# EAGLE design openSX70_ALPHA-2_V6-2-51-20190105-S2-22 (EAGLE 9.2.0)
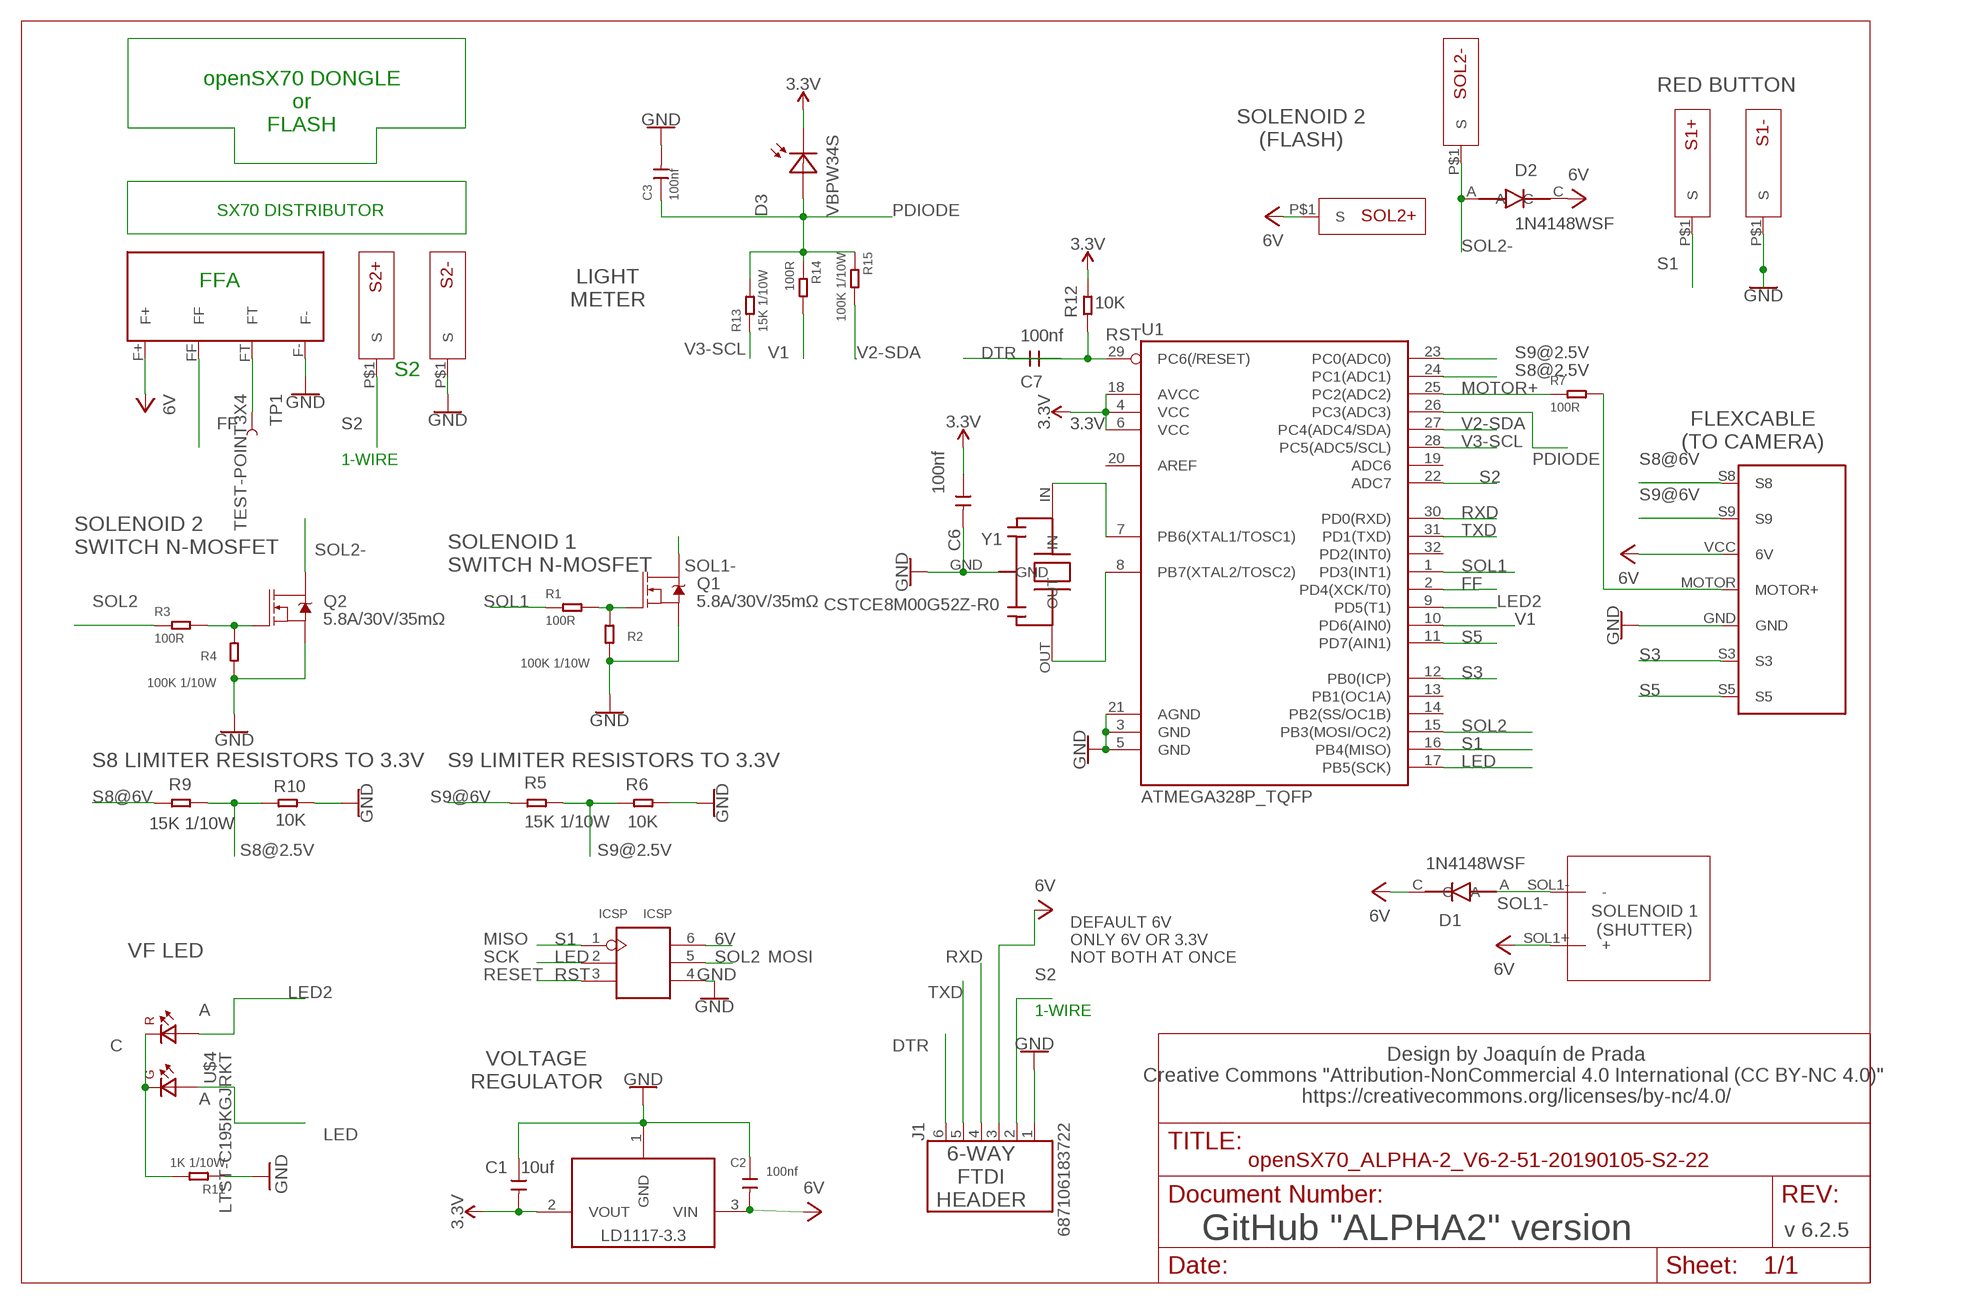
[diagram p0: schematic, sheet 1]

## Parts
C1  10uf  CERAMIC-10UF-10V-10%-X5R(0603)  [C0603]
C2  100nf  CERAMIC-100NF-50V-10%-X7R(0603)  [C0603]
C3  100nf  CERAMIC-100NF-50V-10%-X7R(0603)  [C0603]
C6  100nf  CERAMIC-100NF-50V-10%-X7R(0603)  [C0603]
C7  100nf  CERAMIC-100NF-50V-10%-X7R(0603)  [C0603]
D1  1N4148WSF  1N4148WS  [SODFL2512X100N]
D2  1N4148WSF  1N4148WS  [SODFL2512X100N]
D3  VBPW34S  [SOD6439X130N]
ICSP  ICSP  [H2X3-2.54]
J1  687106183722  [687106183722]
LD11172.5V  LD1117 2.5V  LD1117-3.3  [SOT223]
Q1  5.8A/30V/35mΩ  MOSFET-NCH-AO3404A  [SOT23-3]
Q2  5.8A/30V/35mΩ  MOSFET-NCH-AO3404A  [SOT23-3]
R1  100R  SMD-RES-100R-5%-1/10W(0603)  [R0603]
R2  100K 1/10W  SMD-RES-100K-5%-1/10W(0603)  [R0603]
R3  100R  SMD-RES-100R-5%-1/10W(0603)  [R0603]
R4  100K 1/10W  SMD-RES-100K-5%-1/10W(0603)  [R0603]
R5  15K 1/10W  SMD-RES-15K-1%-1/10W(0603)  [R0603]
R6  10K  SMD-RES-10K-1%-1/10W(0603)  [R0603]
R7  100R  SMD-RES-100R-5%-1/10W(0603)  [R0603]
R9  15K 1/10W  SMD-RES-15K-1%-1/10W(0603)  [R0603]
R10  10K  SMD-RES-10K-1%-1/10W(0603)  [R0603]
R11  1K 1/10W  SMD-RES-1K-5%-1/10W(0603)  [R0603]
R12  10K  SMD-RES-10K-1%-1/10W(0603)  [R0603]
R13  15K 1/10W  SMD-RES-15K-1%-1/10W(0603)  [R0603]
R14  100R  SMD-RES-100R-5%-1/10W(0603)  [R0603]
R15  100K 1/10W  SMD-RES-100K-5%-1/10W(0603)  [R0603]
S1+  SX70-S-PAD-NEW  [SX70-S-PAD2]
S1-  SX70-S-PAD-NEW  [SX70-S-PAD2]
S2+  SX70-S-PAD-NEW  [SX70-S-PAD2]
S2-  SX70-S-PAD-NEW  [SX70-S-PAD2]
SOL1  SX70-SOLENOID1-2PADS  [SX70-SOLENOID1-2]
SOL2+  SX70-S-PAD-NEW  [SX70-S-PAD2]
SOL2-  SX70-S-PAD-NEW  [SX70-S-PAD2]
TP1  TEST-POINT3X4  [PAD.03X.04]
U1  ATMEGA328P_TQFP  [TQFP32-08]
U$1  SX70-7-PAD  [SX70-7-PAD-PROPER]
U$2  FFA  SX70-FFA-PAD  [FFA-PAD-PACKAGE]
U$4  LTST-C195KGJRKT  [LTST-BILED-15X16]
Y1  CSTCE8M00G52Z-R0  CSTCE16M0V53-R0  [CFP95P160X100-3N]

## Nets
3.3V: C1.2 C6.1 D3.C LD11172.5V.2(VOUT) R12.2 U1.4(VCC) U1.6(VCC) U1.18(AVCC)
6V: C2.2 D1.C D2.C ICSP.6(VCC) J1.3 LD11172.5V.3(VIN) SOL1.SOL1+(+) SOL2+.P$1(S) U$1.VCC(6V) U$2.F+
DTR: C7.1 J1.6
FF: U1.2(PD4(XCK/T0)) U$2.FF
GND: C1.1 C2.1 C3.2 C6.2 ICSP.4(GND) J1.1 LD11172.5V.1(GND) Q1.2(S) Q2.2(S) R2.1 R4.1 R6.2 R10.2 R11.1 S1-.P$1(S) S2-.P$1(S) U1.3(GND) U1.5(GND) U1.21(AGND) U$1.GND U$2.F- Y1.GND
LED: ICSP.2(SCK) U1.17(PB5(SCK)) U$4.P$1(A1)
LED2: U1.9(PD5(T1)) U$4.P$2(A2)
MOTOR+: R7.1 U1.25(PC2(ADC2))
MOTOR-HEADER: R7.2 U$1.MOTOR(MOTOR+)
N$1: Q1.1(G) R1.2 R2.2
N$2: R11.2 U$4.P$3(K1) U$4.P$4(K2)
N$3: Q2.1(G) R3.2 R4.2
N$4: U1.7(PB6(XTAL1/TOSC1)) Y1.IN
N$5: TP1.P$1 U$2.FT
N$6: U1.8(PB7(XTAL2/TOSC2)) Y1.OUT
PDIODE: C3.1 D3.A R13.2 R14.1 R15.1 U1.26(PC3(ADC3))
RST: C7.2 ICSP.3(RST) R12.1 U1.29(PC6(/RESET))
RXD: J1.4 U1.30(PD0(RXD))
S1: ICSP.1(MISO) S1+.P$1(S) U1.16(PB4(MISO))
S2: J1.2 S2+.P$1(S) U1.22(ADC7)
S3: U1.12(PB0(ICP)) U$1.S3
S5: U1.11(PD7(AIN1)) U$1.S5
S8@2.5V: R9.2 R10.1 U1.24(PC1(ADC1))
S8@6V: R9.1 U$1.S8
S9@2.5V: R5.2 R6.1 U1.23(PC0(ADC0))
S9@6V: R5.1 U$1.S9
SOL1: R1.1 U1.1(PD3(INT1))
SOL1-: D1.A Q1.3(D) SOL1.SOL1-(-)
SOL2: ICSP.5(MOSI) R3.1 U1.15(PB3(MOSI/OC2))
SOL2-: D2.A Q2.3(D) SOL2-.P$1(S)
TXD: J1.5 U1.31(PD1(TXD))
V1: R14.2 U1.10(PD6(AIN0))
V2-SDA: R15.2 U1.27(PC4(ADC4/SDA))
V3-SCL: R13.1 U1.28(PC5(ADC5/SCL))
Unconnected: U1.13(PB1(OC1A)) U1.14(PB2(SS/OC1B)) U1.19(ADC6) U1.20(AREF) U1.32(PD2(INT0))

## Notes on the sheet
- RED BUTTON
- openSX70 DONGLE
  or
  FLASH
- SOLENOID 2
  (FLASH)
- SX70 DISTRIBUTOR
- FFA
- LIGHT
  METER
- S2
- FLEXCABLE
  (TO CAMERA)
- 1-WIRE
- SOLENOID 2
  SWITCH N-MOSFET
- SOLENOID 1
  SWITCH N-MOSFET
- S8 LIMITER RESISTORS TO 3.3V | S9 LIMITER RESISTORS TO 3.3V
- SOLENOID 1
  (SHUTTER)
- MISO
- SCK | MOSI
- VF LED | RESET
- DEFAULT 6V
  ONLY 6V OR 3.3V
  NOT BOTH AT ONCE
- A | 1-WIRE
- C
- VOLTAGE
  REGULATOR
- Design by Joaquín de Prada
  Creative Commons "Attribution-NonCommercial 4.0 International (CC BY-NC 4.0)" 
  https://creativecommons.org/licenses/by-nc/4.0/
- A
- 6-WAY
  FTDI
  HEADER
- v 6.2.5
- GitHub "ALPHA2" version

## Library data of the parts
C1 = Seeed-Capacitor:CERAMIC-10UF-10V-10%-X5R(0603): 302010103; MPN: CC0603KRX5R6BB106
C2 C3 C6 C7 = Seeed-Capacitor:CERAMIC-100NF-50V-10%-X7R(0603): 302010138; MPN: CC0603KRX7R9BB104
D1 D2 = Common-Parts-Library-Eagle:1N4148WS: 1N4148WS Series 75 V 300 mA Surface Mount Small Signal Diodes - SOD-323F; MANUFACTURER: Fairchild Semiconductor
D3 = VBPW34S:VBPW34S: VBPW34SR Series 60 V 940 nm 50 mA 215 mW Surface Mount Silicon PIN Photodiode; DESCRIPTION: VBPW34SR Series 60 V 940 nm 50 mA 215 mW Surface Mount Silicon PIN Photodiode; DIGI-KEY_PART_NUMBER: 751-1500-1-ND; DIGI-KEY_PURCHASE_URL: https://www.digikey.es/product-detail/en/vishay-semiconductor-opto-division/VBPW34S/751-1500-1-ND/2354866?utm_source=snapeda&utm_medium=aggregator&utm_campaign=symbol; MF: Vishay; MP: VBPW34S; PACKAGE: SMD-2 Vishay
ICSP = openSX70:ICSP
J1 = 687106183722:687106183722: 687106183722 WR-FPC 0.50mm SMT Horizontal Bottom Contact - Low Profile <http://katalog.we-online.de/media/images/v2/Family_WR-FPC_6871xx183722.jpg> Details see: http://katalog.we-online.de/en/em/FPC_0_5_SMT_ZIF_HORIZONTAL_BOTTOM_CONTACT_LOW_PROFILE_6871xx183722 Created by Yingchun,shan 2016 (C) Wurth Elektronik; AVAILABILITY: Good; DESCRIPTION: CONN FFC BTM 6POS 0.5MM SMD R/A; MF: Wurth Electronics; MP: 687106183722; PACKAGE: None; PRICE: 1.21 USD
LD11172.5V = openSX70:LD1117-3.3; AVAILABILITY: Unavailable; DESCRIPTION: Sot223/Pkg 1-Amp 5-Volt Low Drop Out Voltage Regulatator; MF: Advanced Monolithic Systems; MP: AMS1117-5.0; PACKAGE: None; PRICE: None
Q1 Q2 = openSX70:MOSFET-NCH: N-channel MOSFETs Voltage controlled devices that allow control of high current outputs. SparkFun Products: SparkFun OpenScale <https://www.sparkfun.com/products/13261> SparkFun Digital Sandbox <https://www.sparkfun.com/products/12651> SparkFun Monster Moto Shield <https://www.sparkfun.com/products/10182> SparkFun MOSFET Power Controller <https://www.sparkfun.com/products/11214>; PROD_ID: TRANS-12988
R1 R3 R7 R14 = Seeed-Resistor:SMD-RES-100R-5%-1/10W(0603): 301010090; MPN: RC0603JR-07100RL
R2 R4 R15 = Seeed-Resistor:SMD-RES-100K-5%-1/10W(0603): 301010089; MPN: RC0603JR-07100KL
R5 R9 R13 = Seeed-Resistor:SMD-RES-15K-1%-1/10W(0603): 301010241; MPN: RC0603FR-0715KL
R6 R10 R12 = Seeed-Resistor:SMD-RES-10K-1%-1/10W(0603): 301010299; MPN: RC0603FR-0710KL
R11 = Seeed-Resistor:SMD-RES-1K-5%-1/10W(0603): 301010291; MPN: RC0603JR-071KL
S1+ S1- S2+ S2- SOL2+ SOL2- = openSX70:SX70-S-PAD-NEW
SOL1 = openSX70:SX70-SOLENOID1-2PADS
TP1 = SparkFun-Connectors:TEST-POINT: SparkFun Test Points Bare copper test points for troubleshooting or In-Circuit-Testing. These are used by our Production team for verifying production board runs using pogo-pins on test beds. SparkFun Products: SparkFun LSM9DS1 Breakout <https://www.sparkfun.com/products/13284> SparkFun PSOC <https://www.sparkfun.com/products/13714> SparkFun Load Cell Amplifier <https://www.sparkfun.com/products/13879>
U1 = openSX70:ATMEGA328P_TQFP: Popular 328P in QFP Storefront component: ATmega328 - TQFP <https://www.sparkfun.com/products/13448> (COM-13448) Datasheet <http://www.sparkfun.com/datasheets/Components/SMD/ATMega328.pdf> SparkFun Products SparkFun RedBoard - Programmed with Arduino <https://www.sparkfun.com/products/12757> (DEV-12757) Arduino Pro Mini 328 - 5V/16MHz <https://www.sparkfun.com/products/11113> (DEV-11113) Arduino Pro Mini 328 - 3.3V/8MHz <https://www.sparkfun.com/products/11114> (DEV-11114) SparkFun OpenLog <https://www.sparkfun.com/products/13712> (DEV-13712) SparkFun MicroView - OLED Arduino Module <https://www.sparkfun.com/products/12923> (DEV-12923) SparkFun Digital Sandbox <https://www.sparkfun.com/products/12651> (DEV-12651) SparkFun PicoBoard <https://www.sparkfun.com/products/11888> (WIG-11888) Arduino Fio <https://www.sparkfun.com/products/10116> (DEV-10116) LilyPad Arduino 328 Main Board <https://www.sparkfun.com/products/13342> (DEV-13342) SparkFun RedStick <https://www.sparkfun.com/products/13741> (DEV-13741) LilyPad MP3 <https://www.sparkfun.com/products/11013> (DEV-11013) LilyPad Arduino SimpleSnap <https://www.sparkfun.com/products/10941> (DEV-10941) SparkFun Stepoko <https://www.sparkfun.com/products/13899> (ROB-13899) SparkFun Geiger Counter <https://www.sparkfun.com/products/11345> (SEN-11345) SparkFun EL Sequencer <https://www.sparkfun.com/products/12781> (COM-12781) Arduino Pro 328 - 5V/16MHz <https://www.sparkfun.com/products/10915> (DEV-10915) CryptoCape <https://www.sparkfun.com/products/12773> (DEV-12773) SparkFun IR Thermometer Evaluation Board - MLX90614 <https://www.sparkfun.com/products/10740> (SEN-10740) SparkFun RedBot Mainboard <https://www.sparkfun.com/products/12097> (ROB-12097) Arduino Pro 328 - 3.3V/8MHz <https://www.sparkfun.com/products/10914> (DEV-10914) SparkFun Block for Intel® Edison - Arduino <https://www.sparkfun.com/products/13036> (DEV-13036) SparkFun Simon Says - Surface Mount Soldering Kit <https://www.sparkfun.com/products/10935> (KIT-10935) SparkFun 7-Segment Serial Display - Red <https://www.sparkfun.com/products/11441> (COM-11441) SparkFun 7-Segment Serial Display - White <https://www.sparkfun.com/products/11629> (COM-11629) SparkFun 7-Segment Serial Display - Yellow <https://www.sparkfun.com/products/11443> (COM-11443) SparkFun 7-Segment Serial Display - Kelly Green <https://www.sparkfun.com/products/11440> (COM-11440) SparkFun 7-Segment Serial Display - Blue <https://www.sparkfun.com/products/11442> (COM-11442) SparkFun OpenSegment Serial Display - 20mm (Blue) <https://www.sparkfun.com/products/11647> (COM-11647) SparkFun OpenSegment Serial Display - 20mm (Green) <https://www.sparkfun.com/products/11646> (COM-11646) SparkFun OpenSegment Serial Display - 20mm (White) <https://www.sparkfun.com/products/11648> (COM-11648) SparkFun OpenSegment Serial Display - 20mm (Red) <https://www.sparkfun.com/products/11644> (COM-11644) SparkFun OpenSegment Serial Display - 20mm (Yellow) <https://www.sparkfun.com/products/11645> (COM-11645) SparkFun OpenSegment Shield <https://www.sparkfun.com/products/13190> (DEV-13190); PROD_ID: IC-09069
U$1 = _openSX70:SX70-7-PAD
U$2 = openSX70:SX70-FFA-PAD
U$4 = LTST-C195KGJRKT:LTST-C195KGJRKT; AVAILABILITY: Unavailable; DESCRIPTION: Green/Red 130° Water Clear 35/25 mcd 2 V 0605 Surface Mount Bi-Color LED; MF: Lite-On Inc.; MP: LTST-C195KGJRKT; PACKAGE: 0606 Lite-On; PRICE: None
Y1 = CSTCE16M0V53-R0:CSTCE16M0V53-R0: Ceramic Resonator 16MHz ±0.5% (Tol) ±0.3% (Stability) 15pF 40Ohm 3-Pin CSMD T/R; AVAILABILITY: Good; DESCRIPTION: Ceramic Resonator 16MHz ??0.5% (Tol) ??0.3% (Stability) 15pF 40Ohm 3-Pin CSMD T/R; MF: Murata; MP: CSTCE16M0V53-R0; PACKAGE: SMD-3 Murata; PRICE: 0.28 USD

## Net classes
0 default: width 0.254 mm
1 GND: width 0.61 mm

## Board
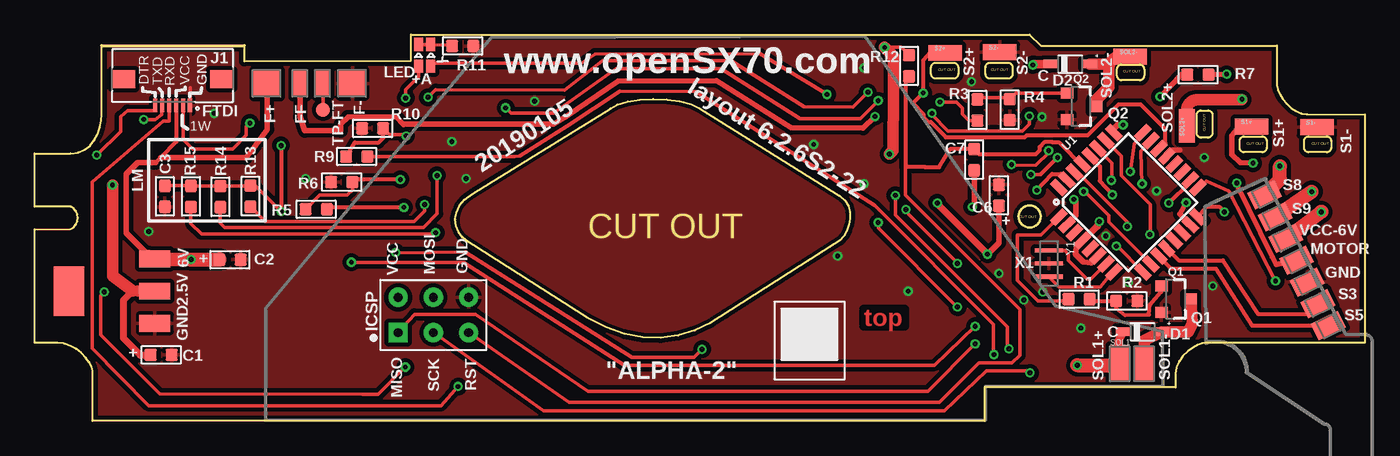
[diagram p1: board, top side]
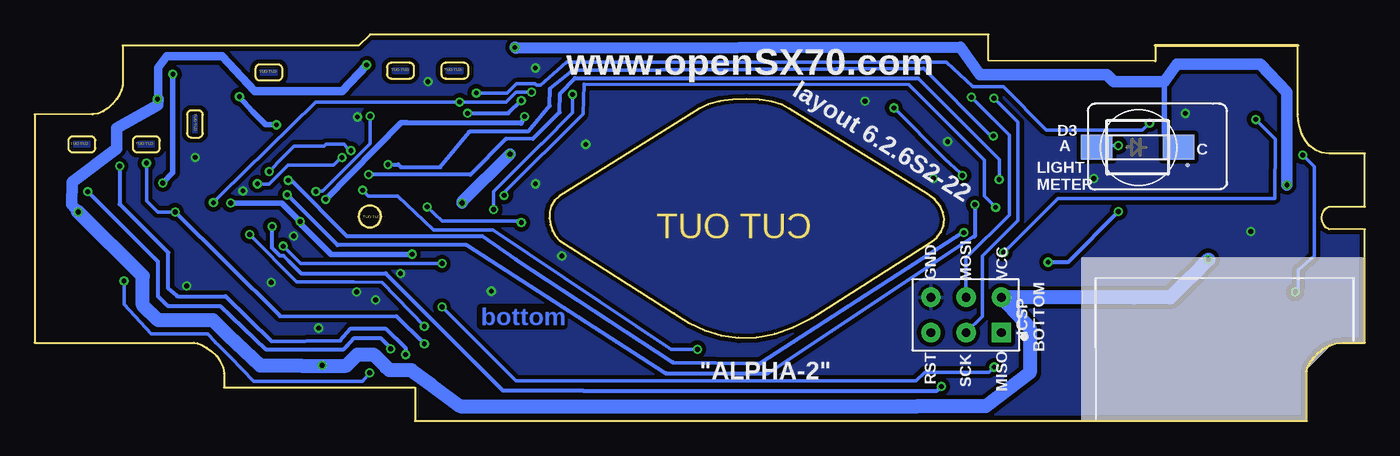
[diagram p2: board, bottom side, seen from below]

Size 95.88 x 27.86 mm. Coordinates in mm from the lower left corner, seen from the top.
Outline: 71.72,15.54 71.88,15.53 72.03,15.48 72.17,15.41 72.29,15.31
Outline: 72.29,15.31 72.39,15.19 72.46,15.06 72.51,14.91 72.52,14.74
Outline: 72.52,14.74 72.51,14.58 72.46,14.43 72.39,14.3 72.29,14.18
Outline: 72.29,14.18 72.17,14.08 72.03,14.01 71.88,13.96 71.72,13.94
Outline: 71.72,13.94 71.56,13.96 71.41,14.01 71.28,14.08 71.16,14.18
Outline: 71.16,14.18 71.06,14.3 70.99,14.43 70.94,14.58 70.92,14.74
Outline: 70.92,14.74 70.94,14.91 70.99,15.06 71.06,15.19 71.16,15.31
Outline: 71.16,15.31 71.28,15.41 71.41,15.48 71.56,15.53 71.72,15.54
Outline: 71.72,15.54 71.57,15.53 71.42,15.48 71.28,15.41 71.16,15.31
Outline: 71.16,15.31 71.06,15.19 70.98,15.05 70.94,14.9 70.92,14.74
Outline: 70.92,14.74 70.94,14.59 70.98,14.44 71.06,14.3 71.16,14.18
Outline: 71.16,14.18 71.28,14.08 71.42,14.01 71.57,13.96 71.72,13.94
Outline: 71.72,13.94 71.88,13.96 72.03,14.01 72.17,14.08 72.29,14.18
Outline: 72.29,14.18 72.39,14.3 72.46,14.44 72.51,14.59 72.52,14.74
Outline: 72.52,14.74 72.51,14.9 72.46,15.05 72.39,15.19 72.29,15.31
Outline: 72.29,15.31 72.17,15.41 72.03,15.48 71.88,15.53 71.72,15.54
Outline: 91.7,22.11 91.77,22.11 95.88,22.11 95.88,5.64 84.4,5.64 84.15,5.6 83.83,5.47 83.48,5.27 83.11,5.01 82.78,4.68 82.5,4.3 82.31,3.87 82.24,3.4 82.24,2.41 68.47,2.41 68.47,0 4.17,0 4.17,3.6 4.11,3.9 3.94,4.23 3.69,4.56 3.36,4.89 2.98,5.18 2.56,5.42 2.11,5.58 1.66,5.64 0,5.64 0,13.82 2.59,13.84 2.81,13.96 2.98,14.15 3.07,14.39 3.1,14.65 3.07,14.91 2.97,15.15 2.81,15.34 2.59,15.45 0,15.46 0,19.29 2.59,19.29 3.14,19.36 3.6,19.56 3.99,19.87 4.3,20.26 4.53,20.7 4.7,21.17 4.79,21.65 4.82,22.11 4.82,27.07 15.1,27.07 15.1,25.94 27.12,26 27.12,27.86 71.71,27.86 72.52,27.07 89.55,27.07 89.55,24.21 89.61,23.9 89.76,23.56 89.97,23.21 90.25,22.87 90.57,22.57 90.93,22.33 91.31,22.17 91.7,22.11
Outline: 83.76,20.77 83.76,22.06 83.77,22.12 83.79,22.19 83.82,22.24 83.86,22.29 83.91,22.33 83.96,22.36 84.03,22.38 84.09,22.39 84.57,22.39 84.64,22.38 84.7,22.36 84.76,22.33 84.81,22.29 84.85,22.24 84.88,22.19 84.9,22.12 84.9,22.06 84.9,20.77 84.9,20.7 84.88,20.64 84.85,20.58 84.81,20.53 84.76,20.49 84.7,20.46 84.64,20.44 84.57,20.44 84.09,20.44 84.03,20.44 83.96,20.46 83.91,20.49 83.86,20.53 83.82,20.58 83.79,20.64 83.77,20.7 83.76,20.77
Outline: 87.19,20.53 88.48,20.53 88.54,20.52 88.61,20.5 88.66,20.47 88.71,20.43 88.75,20.38 88.78,20.32 88.8,20.26 88.81,20.19 88.81,19.71 88.8,19.65 88.78,19.59 88.75,19.53 88.71,19.48 88.66,19.44 88.61,19.41 88.54,19.39 88.48,19.38 87.19,19.38 87.12,19.39 87.06,19.41 87,19.44 86.95,19.48 86.91,19.53 86.88,19.59 86.86,19.65 86.86,19.71 86.86,20.19 86.86,20.26 86.88,20.32 86.91,20.38 86.95,20.43 87,20.47 87.06,20.5 87.12,20.52 87.19,20.53
Outline: 91.84,20.53 93.13,20.53 93.2,20.52 93.26,20.5 93.32,20.47 93.37,20.43 93.41,20.38 93.44,20.32 93.46,20.26 93.46,20.19 93.46,19.71 93.46,19.65 93.44,19.59 93.41,19.53 93.37,19.48 93.32,19.44 93.26,19.41 93.2,19.39 93.13,19.38 91.84,19.38 91.78,19.39 91.71,19.41 91.66,19.44 91.61,19.48 91.57,19.53 91.54,19.59 91.52,19.65 91.51,19.71 91.51,20.19 91.52,20.26 91.54,20.32 91.57,20.38 91.61,20.43 91.66,20.47 91.71,20.5 91.78,20.52 91.84,20.53
Outline: 78.36,25.71 79.65,25.71 79.71,25.7 79.78,25.68 79.83,25.65 79.88,25.61 79.92,25.56 79.95,25.5 79.97,25.44 79.98,25.37 79.98,24.9 79.97,24.83 79.95,24.77 79.92,24.71 79.88,24.66 79.83,24.62 79.78,24.59 79.71,24.57 79.65,24.56 78.36,24.56 78.29,24.57 78.23,24.59 78.17,24.62 78.12,24.66 78.08,24.71 78.05,24.77 78.03,24.83 78.02,24.9 78.02,25.37 78.03,25.44 78.05,25.5 78.08,25.56 78.12,25.61 78.17,25.65 78.23,25.68 78.29,25.7 78.36,25.71
Outline: 68.87,25.84 70.16,25.84 70.23,25.83 70.29,25.81 70.35,25.78 70.39,25.74 70.43,25.69 70.47,25.63 70.49,25.57 70.49,25.51 70.49,25.03 70.49,24.96 70.47,24.9 70.43,24.84 70.39,24.79 70.35,24.75 70.29,24.72 70.23,24.7 70.16,24.69 68.87,24.69 68.8,24.7 68.74,24.72 68.68,24.75 68.64,24.79 68.59,24.84 68.56,24.9 68.54,24.96 68.54,25.03 68.54,25.51 68.54,25.57 68.56,25.63 68.59,25.69 68.64,25.74 68.68,25.78 68.74,25.81 68.8,25.83 68.87,25.84
Outline: 64.95,25.84 66.24,25.84 66.31,25.83 66.37,25.81 66.43,25.78 66.48,25.74 66.52,25.69 66.55,25.63 66.57,25.57 66.57,25.51 66.57,25.03 66.57,24.96 66.55,24.9 66.52,24.84 66.48,24.79 66.43,24.75 66.37,24.72 66.31,24.7 66.24,24.69 64.95,24.69 64.88,24.7 64.82,24.72 64.77,24.75 64.72,24.79 64.68,24.84 64.65,24.9 64.63,24.96 64.62,25.03 64.62,25.51 64.63,25.57 64.65,25.63 64.68,25.69 64.72,25.74 64.77,25.78 64.82,25.81 64.88,25.83 64.95,25.84
Outline: 31.52,16.35 41.5,22.53 42.01,22.82 42.74,23.03 43.62,23.16 44.59,23.21 45.57,23.18 46.5,23.06 47.32,22.84 47.95,22.53 58.05,16.23 58.41,15.9 58.64,15.51 58.76,15.07 58.78,14.61 58.71,14.16 58.56,13.73 58.34,13.34 58.06,13.03 49.78,7.77 48.71,7.05 47.57,6.51 46.38,6.16 45.13,5.99 43.84,6.03 42.53,6.28 41.2,6.75 39.87,7.45 31.22,12.93 30.83,13.23 30.55,13.62 30.37,14.06 30.32,14.55 30.4,15.04 30.62,15.52 30.99,15.97 31.52,16.35
Copper layers (1*16): Top 0.035mm / dielectric 1.5mm / Bottom 0.035mm
Design rules "SeeedStudio_2layer_DRU_no_angle_20140221": minimum track width 6mil, minimum drill 12mil, track to track 6mil, track to pad 6mil, pad to pad 6mil, via to via 6mil, smd to smd 0mil, copper to edge 10mil, drill to drill 10mil, minimum pad ring 10mil, minimum via ring 6mil, stop-mask expansion 2mil, vias tented up to drill 100mil, thermal gap 10mil

### Footprints (pad centres in the part's own frame; a part is rotated, then mirrored left to right if it is on the bottom)
C0603 = smd 0.889 x 0.889: 1 0,0.762; 2 0,-0.762
SODFL2512X100N = smd 1.05 x 0.6: A 1.4,0; C -1.4,0
SOD6439X130N = smd 2.286 x 1.8: A 2.95,0; C -2.95,0
H2X3-2.54 = drill 0.635 pad 1.397 square: 1 -1.27,2.54 | drill 0.635 pad 1.397: 2 -1.27,0; 3 -1.27,-2.54; 4 1.27,-2.54; 5 1.27,0; 6 1.27,2.54
687106183722 = smd 0.3 x 1: 1 -1.25,1.9; 2 -0.75,1.9; 3 -0.25,1.9; 4 0.25,1.9; 5 0.75,1.9; 6 1.25,1.9 | smd 1.65 x 1.3: Z1 -3.525,0; Z2 3.525,0
SOT223 = smd 2.235 x 1.219: 1 -3.099,2.311; 2 -3.099,0; 3 -3.099,-2.311 | smd 2.2 x 3.6: 4 3.099,0
SOT23-3 = smd 0.8 x 0.9: 1 -0.95,-1; 2 0.95,-1; 3 0,1.1
R0603 = smd 0.889 x 0.889: 1 0,0.762; 2 0,-0.762
SX70-S-PAD2 = smd 2.413 x 1.143: P$1 0.01,0.087
SX70-SOLENOID1-2 = smd 1.372 x 2.54: SOL1+ -0.826,0.127; SOL1- 0.953,0.127
PAD.03X.04 = smd 1.016 x 1.016: P$1 0,0
TQFP32-08 = smd 1.27 x 0.559: 1 -4.293,2.8; 2 -4.293,2; 3 -4.293,1.2; 4 -4.293,0.4; 5 -4.293,-0.4; 6 -4.293,-1.2; 7 -4.293,-2; 8 -4.293,-2.8; 17 4.293,-2.8; 18 4.293,-2; 19 4.293,-1.2; 20 4.293,-0.4; 21 4.293,0.4; 22 4.293,1.2; 23 4.293,2; 24 4.293,2.8 | smd 0.559 x 1.27: 9 -2.8,-4.293; 10 -2,-4.293; 11 -1.2,-4.293; 12 -0.4,-4.293; 13 0.4,-4.293; 14 1.2,-4.293; 15 2,-4.293; 16 2.8,-4.293; 25 2.8,4.293; 26 2,4.293; 27 1.2,4.293; 28 0.4,4.293; 29 -0.4,4.293; 30 -1.2,4.293; 31 -2,4.293; 32 -2.8,4.293
SX70-7-PAD-PROPER = smd 1.31 x 2.159: GND 7.875,1.312; MOTOR 6.125,1.312; S3 9.625,1.312; S5 11.375,1.312; S8 0.875,1.312; S9 2.625,1.312; VCC 4.375,1.312
FFA-PAD-PACKAGE = smd 1.95 x 1.95: F+ -3.277,-0.013; F- 2.87,0 | smd 1.05 x 1.95: FF -0.914,0; FT 0.737,0.025
LTST-BILED-15X16 = smd 0.65 x 0.952: P$1 0.425,0.776; P$2 -0.425,0.776; P$3 0.425,-0.776; P$4 -0.425,-0.776
CFP95P160X100-3N = smd 0.3 x 2.032: GND 0.038,0.175; IN -0.912,0.177; OUT 0.992,0.174

### Placement (x,y rotation side)
C1  9.12,4.76 270 top
C2  14.08,11.63 270 top
C3  9.38,16.2 0 top
C6  69.51,16.28 180 top
C7  67.73,18.84 180 top
D1  79.86,6.43 0 top
D2  74.65,25.74 0 top
D3  16.38,19.75 180 bottom
ICSP  28.74,7.64 90 top
J1  9.94,24.66 180 top
LD11172.5V  5.56,9.36 180 top
Q1  82.23,8.78 270 top
Q2  75.41,22.69 270 top
R1  75.28,8.78 90 top
R2  78.72,8.66 270 top
R3  67.96,22.43 180 top
R4  70.29,22.45 180 top
R5  20.29,15.26 270 top
R6  22.14,17.23 270 top
R7  83.86,24.98 90 top
R9  23.21,19.07 270 top
R10  24.36,21.1 270 top
R11  30.85,27.05 270 top
R12  63.03,25.61 180 top
R13  15.55,16.22 180 top
R14  13.39,16.17 0 top
R15  11.26,16.2 0 top
S1+  87.72,21.14 0 top
S1-  92.42,21.09 0 top
S2+  65.62,26.46 0 top
S2-  69.56,26.51 0 top
SOL1  79.03,4.05 0 top
SOL2+  83.14,21.28 90 top
SOL2-  78.96,26.19 0 top
TP1  20.78,22.44 0 top
U1  78.84,15.77 45 top
U$1  87.1,16.52 296 top
U$2  20.04,24.34 0 top
U$4  28.12,26.37 180 top
Y1  72.94,11.39 270 top

### Tracks (layer width: path | path; a pad name or v marks a point on that pad's centre or on a via)
3.3V  (via drill 0.35)
  Top 0.254: R12.2 62.98,26.42 62.99,26.42 62.47,26.94 v61.27,26.94 | 83.29,17.23 U1.18 | 7.47,9.36 7.06,9.37
  Top 0.305: v81.76,15.71 83.29,17.23
  Top 0.406: U1.4 75.08,12.51 75.02,12.04 75.6,11.45 76.16,11.39 U1.6 | C6.1 69.51,12.85 v68.68,12.02
  Top 0.508: U1.4 76.62,14.05 v76.74,14.37 | v65.06,15.72 65.06,15.65 v68.68,12.03 v68.68,12.02 | LD11172.5V.2 | 7.06,9.37 6.39,8.71 6.39,5.97 7.6,4.76 C1.2
  Top 0.813: 7.06,9.37 5.61,10.46 v5.61,17.01 | LD11172.5V.2 7.47,9.36 | v61.62,19.25 61.87,19.5 61.91,23.74 61.91,26.31 v61.27,26.94 | v61.62,19.25
  Bottom 0.406: v81.76,15.71 78.08,15.71 v76.74,14.37 76.74,14.24 74.53,12.02 v68.68,12.02 | 14.45,24.46 14.45,20.76 D3.C
  Bottom 0.813: v5.61,17.01 5.61,23.72 7.53,25.74 13.57,25.74 14.45,24.46 18.09,24.47 18.61,24.98 27.75,24.98 29.15,26.94 61.2,26.87 v61.27,26.94 | v65.06,15.72 65.06,15.82 v61.63,19.25 v61.62,19.25
6V  (via drill 0.35)
  Top 0.254: v87.03,23.2 86.84,23.33 87.03,23.17
  Top 0.305: J1.3 10.21,22.75 10.21,20.13 9.08,19.01 8.71,18.63
  Top 0.406: 8.22,11.94 6.61,13.55 6.61,17.8 7.44,18.64 8.71,18.63 | U$2.F+ 16.76,21.02 15.56,19.4 15.21,18.98 9.08,19.01
  Top 0.61: v71.95,25.68 arc-90 72.01,25.74 D2.C | SOL1.SOL1+ 78.14,5.26 78.14,5.82 D1.C
  Top 0.813: SOL2+.P$1 83.05,22.42 arc-90 83.79,23.17 87.03,23.17 | 8.22,11.94 LD11172.5V.3
  Top 1.016: v75.16,4.01 77.95,4.02 SOL1.SOL1+ | LD11172.5V.3 v11.27,11.64 13.3,11.65 C2.2 | v92.75,15.07 92.72,15.07 U$1.VCC
  Bottom 0.254: v87.03,23.2 86.84,23.33 86.99,23.2
  Bottom 0.61: v71.95,25.68 73.73,23.77 80.02,23.77 82.36,26.31 86.37,26.31 86.97,25.48 86.99,23.2
  Bottom 0.813: 86.71,7.26 86.97,7.26 | 76.68,3.98 v75.16,4.01 | 86.99,23.2 87,22.79 89.95,21.13 89.95,19.64 93.19,17.23 93.21,15.6 v92.75,15.07
  Bottom 1.016: 86.71,7.26 83.03,7.26 81.89,6.12 79.6,3.98 76.68,3.98 73.42,3.98 72.62,4.78 71.46,4.78 70.56,3.89 70.31,3.65 68.74,3.65 67.35,2.65 65.22,1.06 32.2,1.06 27.32,1.06 24.16,3.48 24.16,6.7 ICSP.6 16.63,8.9 14.03,8.9 12.67,10.25 12.52,10.39 v11.27,11.64 | 86.97,7.26 88.08,8.34 88.08,10.44 v92.75,15.07
DTR  (via drill 0.35)
  Top 0.254: v26.72,3.88 24.77,1.93 23.65,1.93 9,1.94 4.74,6.2 4.74,9.02 v5.02,9.3 | v4.48,19.17 6.2,20.88 6.2,21.96 6.7,22.39 8.67,22.39 J1.6 | v66.52,8.21 66.5,8.21 60.81,13.9 v60.81,14.31
  Top 0.406: C7.1 67.73,15.6 v67.59,15.44
  Bottom 0.254: v4.48,19.17 3.65,18.34 3.65,11.9 4.81,10.88 4.81,9.51 v5.02,9.3 | v67.59,15.44 66.53,14.42 60.81,14.43 v60.81,14.31 | v26.72,3.88 27.09,3.51 31.72,3.51 32.36,2.88 61.19,2.88 v66.52,8.21
FF  (via drill 0.35)
  Top 0.406: U$2.FF 19.13,21.94 19.48,20.94 22.07,20.94 22.07,21.42 22.58,21.93 26.04,21.94 26.59,21.39 arc-90 26.6,21.39 37.4,21.39 38.32,21.94 42.05,24.52 49.16,24.53 54.51,21.15 59.72,21.11 v60.57,21.96 | v74.92,15.98 75.04,15.86 75.04,14.8 U1.2
  Bottom 0.406: v60.57,21.96 60.84,21.48 69.06,21.53 69.48,21.53 v74.92,15.98
GND  (via drill 0.35)
  Top 0.254: J1.1 11.19,24.04
  Top 0.406: 82.56,19.52 82.01,19.52 81.59,19.11 U1.21
  other vias: 84.94,9.74 78.84,9.99 84.3,19.01 75.41,6.69 71.3,8.72 80.87,16.59 36.04,23.07 67.54,24.47 72.62,21.93 30.07,20.15 19.53,17.48 69.52,10.63 62.97,9.36 31.09,17.48 8.23,13.67 12.93,22.18 57.89,11.9 59.79,17.1 77.22,13.34 72.67,9.3 56.16,19.95 59.79,25.46
  pour Top (isolate 0.305): 91.7,22.11 91.77,22.11 95.88,22.11 95.88,5.64 84.4,5.64 84.15,5.6 83.83,5.47 83.48,5.27 83.11,5.01 82.78,4.68 82.5,4.3 82.31,3.87 82.24,3.4 82.24,2.41 68.47,2.41 68.47,0 4.17,0 4.17,3.6 4.11,3.9 3.94,4.23 3.69,4.56 3.36,4.89 2.98,5.18 2.56,5.42 2.11,5.58 1.66,5.64 0,5.64 0,13.82 2.59,13.84 2.81,13.96 2.98,14.15 3.07,14.39 3.1,14.65 3.07,14.91 2.97,15.15 2.81,15.34 2.59,15.45 0,15.46 0,19.29 2.59,19.29 3.14,19.36 3.6,19.56 3.99,19.87 4.3,20.25 4.53,20.7 4.7,21.17 4.79,21.65 4.82,22.11 4.82,27.07 15.1,27.07 15.1,25.94 26.96,25.88 27.02,27.86 71.71,27.86 72.52,27.07 89.55,27.07 89.55,24.21 89.61,23.9 89.76,23.56 89.97,23.21 90.25,22.87 90.57,22.57 90.93,22.33 91.31,22.17
  pour Bottom (isolate 0.305): 91.7,22.11 91.77,22.11 95.88,22.11 95.88,5.64 84.4,5.64 84.15,5.6 83.83,5.47 83.48,5.27 83.11,5.01 82.78,4.68 82.5,4.3 82.31,3.87 82.24,3.4 82.24,2.41 68.47,2.41 68.47,0 4.17,0 4.17,3.6 4.11,3.9 3.94,4.23 3.69,4.56 3.36,4.89 2.98,5.18 2.56,5.42 2.11,5.58 1.66,5.64 0,5.64 0,13.82 2.59,13.84 2.81,13.96 2.98,14.15 3.07,14.39 3.1,14.65 3.07,14.91 2.97,15.15 2.81,15.34 2.59,15.45 0,15.46 0,19.29 2.59,19.29 3.14,19.36 3.6,19.56 3.99,19.87 4.3,20.25 4.53,20.7 4.7,21.17 4.79,21.65 4.82,22.11 4.82,27.07 15.1,27.07 14.98,25.69 27.39,25.82 27.58,27.86 71.71,27.86 72.52,27.07 89.55,27.07 89.55,24.21 89.61,23.9 89.76,23.56 89.97,23.21 90.25,22.87 90.57,22.57 90.93,22.33 91.31,22.17
LED  (via drill 0.35)
  Top 0.254: 71.61,3.6 68.59,3.6 65.58,0.72 36.69,0.72 ICSP.2 | U1.17 84.45,17.29 86.08,16.59 v89.45,10.09 | v26.75,23.29 26.75,23.89 27.69,24.83 U$4.P$1
  Top 0.305: 71.61,3.6 v71.75,3.46
  Bottom 0.254: v71.75,3.46 72.25,2.87 80.1,2.87 81.76,4.57 82.66,5.47 82.88,5.68 83.41,6.28 87.48,6.28 89.45,8.4 v89.45,10.09 | v26.75,23.29 25,21.54 25,14.47 27.56,11.91 27.56,7.55 ICSP.2
LED2  (via drill 0.35)
  Top 0.254: U1.9 78.05,12.6 v77.98,12.6 | v66.52,11.35 66.52,11.38 62.8,15.1 v62.8,15.25 | v57.12,23.55 52.29,26.48 40.38,26.47 39.43,25.79 28.61,25.79 28.54,25.72 U$4.P$2
  Bottom 0.254: v77.98,12.6 76.72,11.35 v66.52,11.35 | v57.12,23.55 57.12,22.22 59.36,19.98 59.38,19.95 62.8,16.53 v62.8,15.25
MOTOR+  (via drill 0.35)
  Top 0.406: U1.25 77.57,20.98 77.7,20.98 78.08,21.36 v78.46,21.36 | v81.13,23.39 82.68,25 R7.1
  Bottom 0.406: v78.46,21.36 79.22,21.36 80.17,22.31 v81.13,23.39
MOTOR-HEADER  (via drill 0.35)
  Top 0.406: v86.65,17.17 86.65,17.04 89.23,11.82 89.5,11.28 U$1.MOTOR | v85.92,25.01 R7.2
  Bottom 0.406: v85.92,25.01 85.92,17.9 v86.65,17.17
N$1
  Top 0.254: R1.2 76.11,8.72 76.3,8.72 76.36,8.66
  Top 0.305: Q1.1 81.19,9.29 80.38,8.38 80.32,7.68 78.59,7.64 77.95,8.15 R2.2 76.36,8.66
N$2
  Top 0.254: R11.2 30.04,27.1 U$4.P$4 U$4.P$3
N$3
  Top 0.254: Q2.1 70.71,23.64 R4.2 70.33,23.33 67.79,23.33 R3.2
N$4
  Top 0.254: U1.7 76.13,10.23 75.86,10.23 74.52,11.56 74.52,11.89 74.51,11.9 74.52,11.98 74.52,12.02 74.25,12.3 Y1.IN
N$5
  Top 0.254: U$2.FT TP1.P$1
N$6
  Top 0.254: U1.8 77.4,10.37 76.81,9.67 73.83,9.67 Y1.OUT
N$17
  pour Top: 31.52,16.35 41.5,22.53 42.01,22.82 42.74,23.03 43.62,23.16 44.59,23.21 45.57,23.18 46.5,23.05 47.32,22.84 47.96,22.53 58.05,16.23 58.41,15.9 58.64,15.51 58.77,15.07 58.78,14.61 58.71,14.16 58.56,13.73 58.34,13.34 58.06,13.03 49.78,7.76 48.71,7.05 47.57,6.51 46.38,6.16 45.13,5.99 43.85,6.03 42.53,6.28 41.2,6.75 39.87,7.45 31.22,12.93 30.83,13.23 30.55,13.62 30.37,14.06 30.32,14.55 30.4,15.04 30.62,15.52 30.99,15.97
N$19
  pour Bottom: 83.76,20.77 83.76,22.06 83.77,22.12 83.79,22.19 83.82,22.24 83.86,22.29 83.91,22.33 83.96,22.36 84.03,22.38 84.09,22.39 84.57,22.39 84.64,22.38 84.7,22.36 84.76,22.33 84.81,22.29 84.85,22.24 84.88,22.19 84.9,22.12 84.9,22.06 84.9,20.77 84.9,20.7 84.88,20.64 84.85,20.58 84.81,20.53 84.76,20.49 84.7,20.46 84.64,20.44 84.57,20.44 84.09,20.44 84.03,20.44 83.96,20.46 83.91,20.49 83.86,20.53 83.82,20.58 83.79,20.64 83.77,20.7
N$20
  pour Bottom: 87.19,20.53 88.48,20.53 88.54,20.52 88.61,20.5 88.66,20.47 88.71,20.43 88.75,20.38 88.78,20.32 88.8,20.26 88.81,20.19 88.81,19.71 88.8,19.65 88.78,19.59 88.75,19.53 88.71,19.48 88.66,19.44 88.61,19.41 88.54,19.39 88.48,19.38 87.19,19.38 87.12,19.39 87.06,19.41 87,19.44 86.95,19.48 86.91,19.53 86.88,19.59 86.86,19.65 86.86,19.71 86.86,20.19 86.86,20.26 86.88,20.32 86.91,20.38 86.95,20.43 87,20.47 87.06,20.5 87.12,20.52
N$21
  pour Bottom: 91.84,20.53 93.13,20.53 93.2,20.52 93.26,20.5 93.32,20.47 93.37,20.43 93.41,20.38 93.44,20.32 93.46,20.26 93.46,20.19 93.46,19.71 93.46,19.65 93.44,19.59 93.41,19.53 93.37,19.48 93.32,19.44 93.26,19.41 93.2,19.39 93.13,19.38 91.84,19.38 91.78,19.39 91.71,19.41 91.66,19.44 91.61,19.48 91.57,19.53 91.54,19.59 91.52,19.65 91.51,19.71 91.51,20.19 91.52,20.26 91.54,20.32 91.57,20.38 91.61,20.43 91.66,20.47 91.71,20.5 91.78,20.52
N$22
  pour Bottom: 78.36,25.71 79.65,25.71 79.71,25.7 79.78,25.68 79.83,25.65 79.88,25.61 79.92,25.56 79.95,25.5 79.97,25.44 79.98,25.37 79.98,24.9 79.97,24.83 79.95,24.77 79.92,24.71 79.88,24.66 79.83,24.62 79.78,24.59 79.71,24.57 79.65,24.56 78.36,24.56 78.29,24.57 78.23,24.59 78.17,24.62 78.12,24.66 78.08,24.71 78.05,24.77 78.03,24.83 78.02,24.9 78.02,25.37 78.03,25.44 78.05,25.5 78.08,25.56 78.12,25.61 78.17,25.65 78.23,25.68 78.29,25.7
N$23
  pour Bottom: 68.87,25.84 70.16,25.84 70.23,25.83 70.29,25.81 70.35,25.78 70.39,25.74 70.44,25.69 70.47,25.63 70.49,25.57 70.49,25.5 70.49,25.03 70.49,24.96 70.47,24.9 70.44,24.84 70.39,24.79 70.35,24.75 70.29,24.72 70.23,24.7 70.16,24.69 68.87,24.69 68.8,24.7 68.74,24.72 68.69,24.75 68.64,24.79 68.6,24.84 68.56,24.9 68.55,24.96 68.54,25.03 68.54,25.5 68.55,25.57 68.56,25.63 68.6,25.69 68.64,25.74 68.69,25.78 68.74,25.81 68.8,25.83
N$24
  pour Bottom: 64.95,25.84 66.24,25.84 66.31,25.83 66.37,25.81 66.43,25.78 66.48,25.74 66.52,25.69 66.55,25.63 66.57,25.57 66.57,25.5 66.57,25.03 66.57,24.96 66.55,24.9 66.52,24.84 66.48,24.79 66.43,24.75 66.37,24.72 66.31,24.7 66.24,24.69 64.95,24.69 64.89,24.7 64.82,24.72 64.77,24.75 64.72,24.79 64.68,24.84 64.65,24.9 64.63,24.96 64.62,25.03 64.62,25.5 64.63,25.57 64.65,25.63 64.68,25.69 64.72,25.74 64.77,25.78 64.82,25.81 64.89,25.83
N$25
  pour Bottom: 31.52,16.35 41.5,22.53 42.01,22.82 42.74,23.03 43.62,23.16 44.59,23.21 45.57,23.18 46.5,23.05 47.32,22.84 47.96,22.53 58.05,16.23 58.41,15.9 58.64,15.51 58.77,15.07 58.78,14.61 58.71,14.16 58.56,13.73 58.34,13.34 58.06,13.03 49.78,7.76 48.71,7.05 47.57,6.51 46.38,6.16 45.13,5.99 43.85,6.03 42.53,6.28 41.2,6.75 39.87,7.45 31.22,12.93 30.83,13.23 30.55,13.62 30.37,14.06 30.32,14.55 30.4,15.04 30.62,15.52 30.99,15.97
PDIODE  (via drill 0.35)
  Top 0.254: C3.1 R15.1 13.36,16.96 R14.1 15.51,16.93 R13.2 15.89,16.98 v17.76,15.11 | U1.26 78.33,19.11 78.33,17.7 80.42,15.6 80.42,13.5 80.49,13.48 v80.39,13.44 | v22.83,11.45 30.9,11.45 42.52,4.02 64.87,4.02 v67.79,6.82
  Top 0.305: v17.76,19.87 v17.76,15.11
  Bottom 0.254: v80.39,13.44 76.99,10.04 72.87,10.04 70.84,9.99 v67.79,6.82 | v17.76,19.87 19.21,19.87 D3.A
  Bottom 0.305: v17.76,15.11 21.42,11.45 v22.83,11.45
RST
  Top 0.254: 75.79,18.28 75.72,18.34 U1.29 | 62.77,18.31 62.77,16.28 71.01,8.04 71.01,4.73 70.46,4.18 68.06,4.18 65.31,1.43 65.21,1.35 39.37,1.35 38.53,1.33 ICSP.3 | 62.77,18.41 62.87,18.4 62.87,18.31
  Top 0.305: R12.1 62.78,24.6 62.77,18.41 | 62.77,18.31 62.87,18.31 64.19,18.31 65.19,18.31 65.99,19.6 C7.2 68.1,19.24 72.16,19.24 72.46,19.53 72.46,19.76 72.83,20.13 73.35,20.13 73.38,20.1 73.81,20.1 75.57,18.34 75.72,18.34
RXD  (via drill 0.35)
  Top 0.254: v78.78,14.02 78.78,14.34 75.16,17.96 U1.30 | v30.53,2.48 29.28,1.1 8.22,1.09 4.15,5.23 4.15,17.24 9.25,21.63 9.69,21.62 9.69,21.9 J1.4
  Bottom 0.254: 77.96,11.93 77.56,11.53
  Bottom 0.305: 77.96,11.93 78.22,11.93 78.78,12.49 v78.78,14.02 | 77.56,11.53 76.69,10.64 70.59,10.64 62.12,2.18 56.36,2.18 30.83,2.18 v30.53,2.48
S1  (via drill 0.35)
  Top 0.254: ICSP.1 27.37,7.68 31.8,7.68 39.88,2.14 64.39,2.14 v67.79,5.55
  Top 0.305: U1.16 84.49,15.45 85.38,15.45 v85.76,15.07
  Top 0.406: v87.83,18.59 86.9,18.63 86.3,19.2 86.3,20.56 86.84,21.23 S1+.P$1
  Bottom 0.254: v85.76,15.07 87.03,15.07 87.83,15.86 v87.83,18.59
  Bottom 0.305: v85.76,15.07 78.19,7.57 69.79,7.55 v67.79,5.55
S2  (via drill 0.35)
  Top 0.254: J1.2 10.69,20.3 11.39,19.61 14.27,19.61 15.26,20.6 15.26,21.23 v15.51,21.49
  Top 0.305: S2+.P$1 64.54,26.55 64.04,25.99 v64.04,23.66 63.29,22.91 64.05,22.15 64.05,21.92 64.42,21.55 64.6,21.55 65.57,20.58 65.68,20.47 71.38,20.47 71.49,20.59 73.54,20.59 73.55,20.58 75.89,20.58 78.13,22.82 79.73,22.82 81.51,21.04 81.51,20.03 81.5,20.03 81.12,19.65 U1.22
  Bottom 0.254: v15.51,21.49 16.02,20.98 22.95,20.98 26.07,24.1 28.25,24.1 30.16,25.88 57.56,25.88 59.41,24.21 59.71,24.21 59.81,24.31 61.16,24.31 61.81,23.66 v64.04,23.66
S3
  Top 0.305: U1.12 82.47,11.58 85.65,11.58 88.21,7.69 91.74,7.69 U$1.S3
S5
  Top 0.254: U1.11 81.05,11.89
  Top 0.305: 81.05,11.89 81.89,10.98 85.16,10.98 87.77,6.87 U$1.S5
S8@2.5V  (via drill 0.35)
  Top 0.254: U1.24 79.29,19.99 v78.97,18 | 25.13,20.9 R10.1 25.57,20.66 26.77,20.66 v26.77,20.56 | v73.09,19.5 73.11,19.47 73.11,19.37 72.18,18.44 70.5,18.42 v70.42,18.5
  Top 0.305: R9.2 23.06,20.09 24.8,20.09 25.13,20.42 25.13,20.9
  Bottom 0.254: v78.97,18 77.98,19.05 77.16,19.83 76.84,19.83 75.01,19.83 74.88,19.97 73.58,19.95 73.23,19.5 v73.09,19.5 | 31.81,25.43 26.94,20.56 v26.77,20.56
  Bottom 0.305: v70.42,18.5 69.68,18.5 69.48,18.3 66.65,18.3 64.58,20.84 64.53,20.86 60.33,20.88 58.76,22.72 58.73,23.98 57.12,25.28 31.81,25.43
S8@6V  (via drill 0.35)
  Top 0.254: R9.1 34.61,19.08 34.96,19.11 38.36,21.28 42.19,23.78 47.66,23.75 60.56,15.53 69.11,6.98 69.11,4.83 v69.16,4.78
  Top 1.016: U$1.S8 89.76,17.41 v89.76,18.37
  Bottom 0.305: v89.76,18.37 89.76,15.64 86.26,12.14 86.26,9.55 85.63,9 85.59,8.98 82.12,8.98 78.81,5.74 73.85,5.8 73.11,6.67 70.69,6.67 70.59,6.66 69.16,5.27 v69.16,4.78
S9@2.5V  (via drill 0.35)
  Top 0.254: R5.2 20.55,16.28 22.52,16.28 22.9,16.66 22.9,17.17 22.9,17.42 | v79.82,17.1 79.73,19.45 U1.23
  Top 0.305: v26.36,17.41 22.9,17.42 | 22.9,17.17 R6.1 | v73.74,19 72.53,17.79 v71.82,17.77
  Bottom 0.254: v73.74,19 73.76,19.02 74.33,18.45 77.62,18.45 78.97,17.1 v79.82,17.1 | 32.21,24.71 26.36,18.85 v26.36,17.41
  Bottom 0.305: 32.21,24.71 56.94,24.73 58,23.61 58.03,22.26 59.99,20.34 61.89,20.35 64.47,17.77 v71.82,17.77
S9@6V  (via drill 0.35)
  Top 0.254: v62.04,16.27 62.04,14.86 70.11,6.77 70.11,5.2 v70.24,5.2
  Top 0.305: v26.61,15.41 21.2,15.41 R5.1
  Top 1.016: U$1.S9 v92.05,16.53
  Bottom 0.254: v26.61,15.41 27.42,16.22 27.42,18.81 32.87,24.25 56.28,24.29 56.36,22.15 62.04,16.47 v62.04,16.27
  Bottom 0.305: v92.05,16.53 87,11.48 87,9.01 86.29,8.3 86.23,8.28 82.52,8.28 79.22,5.16 73.6,5.16 73.37,5.42 72.85,5.98 70.96,5.98 70.24,5.26 v70.24,5.2
SOL1
  Top 0.254: U1.1 72.53,13.42 70.84,13.42 70.84,10.12 72.31,8.65 74.3,8.65
  Top 0.305: 74.3,8.65 R1.1
SOL1-
  Top 0.813: Q1.3 83.43,7.03 83.16,6.43 D1.A 79.98,5.8 SOL1.SOL1-
SOL2  (via drill 0.35)
  Top 0.254: v28.36,23.34 28.91,23.9 38.19,23.88 40.95,25.98 50.2,25.99 55.46,22.68 59,22.65 v60.06,23.71 | v65.25,23.01 66.46,23.01 66.89,22.58 66.89,22.14 67.36,21.67 R3.1
  Top 0.406: v83,15.74 82.56,14.91 U1.15
  Bottom 0.254: v83,15.74 82.49,16.28 75.65,23 v65.25,23.01 61.89,23.01 61.19,23.71 60.04,23.71 v60.06,23.71 | ICSP.5 28.74,11.75 25.62,14.86 25.62,20.61 v28.36,23.34
SOL2-
  Top 0.813: SOL2-.P$1 78.23,26.27 arc90 77.44,25.48 | 77.44,25.48 77.44,24.09 76.51,23.16 Q2.3 | D2.A 77.44,25.74 77.44,25.48
TXD  (via drill 0.35)
  Top 0.254: v7.87,21.75 8.7,21.75 9.14,22.09 J1.5 | v26.03,12.15 26.05,12.13 31.03,12.2 43.07,4.57 47.51,4.57 v48.11,5.16 | 74.3,17.45 U1.31
  Top 0.305: v72.25,16.64 73.33,17.82 73.96,17.82 U1.31
  Bottom 0.254: v72.25,16.64 71.86,16.21 69.74,16.21 67.82,14.4 67.14,13.76 63.35,13.76 62.83,13.76 50.01,5.16 v48.11,5.16 | v7.87,21.75 6.45,20.33 6.5,16.06 22.12,16.06 v26.03,12.15
V1  (via drill 0.35)
  Top 0.254: R14.2 13.39,14.27 13.69,13.96 28.03,13.96 29.02,14.95 29.02,17.68 v29,17.7 | v64.69,22.19 64.69,22.09 65.85,20.92 71.2,20.9 71.7,21.41 v71.7,21.99 | v33.95,22.58 34.33,22.2 37.39,22.2 41.91,25.4 49.47,25.4 55.17,21.8 59.54,21.8 v60.81,23.1 | U1.10 77.44,14.34 77.44,14.82 75.72,16.54 v75.61,16.54
  Bottom 0.254: v29,17.7 29.17,17.87 30.26,18.89 v33.95,22.58 | 60.76,23.19 v60.81,23.1 | v75.61,16.54 75.58,16.58 75.12,16.58 71.7,20 v71.7,21.99
  Bottom 0.305: v64.69,22.19 61.75,22.19 60.76,23.19
V2-SDA  (via drill 0.35)
  Top 0.254: R15.2 11.26,14.26 12.02,13.49 28.91,13.49 v28.91,13.58 | U1.27 77.66,18.62 77.65,17.35
  Top 0.305: 77.65,17.35 v77.6,17.36
  Bottom 0.254: 28.92,13.64 28.99,13.58 v28.91,13.58
  Bottom 0.305: v77.6,17.36 77.41,17.36 73.36,13.3 63.61,13.3 61.21,11.66 49.9,4.23 43.59,4.15 28.92,13.64
V3-SCL  (via drill 0.35)
  Top 0.254: R13.1 16.61,14.4 27.36,14.4 28.11,15.14 v28.11,15.6
  Top 0.305: U1.28 76.8,18.35 76.78,17.31 v77.69,16.31
  Bottom 0.305: v77.69,16.31 74.06,12.68 64.74,12.68 50.41,3.44 43.01,3.44 42.78,3.59 28.17,13.29 28.11,13.35 v28.11,15.6

### Text on the board
Top: top
Bottom: bottom
Dimension: CUT OUT | CUT OUT | CUT OUT | CUT OUT | CUT OUT | CUT OUT | CUT OUT | CUT OUT
tPlace: www.openSX70.com | www.openSX70.com | S2+ | S2- | DTR | TXD | RXD | VCC | GND | GND | layout 6.2.6S2-22 | C | F+ | FF | F- | 20190105 | SOL2- | FTDI | Q2 | 1W | SOL2+ | TP-FT | S1+ | S1- | LM | S8 | S9 | VCC-6V | MOTOR | 6V | X1 | VCC | MOSI | GND | GND | S3 | 2.5V | Q1 | S5 | GND | C | MISO | SCK | RST | "ALPHA-2" | SOL1+ | SOL1-
bPlace: www.openSX70.com | layout 6.2.6S2-22 | LIGHT / METER | VCC | MOSI | GND | ICSP / BOTTOM | MISO | SCK | RST | "ALPHA-2"
tNames: LED | A+ | + | + | +
tDocu: Creative Commons "Attribution-NonCommercial 4.0 International (CC BY-NC 4.0)" / https://creativecommons.org/licenses/by-nc/4.0/ | ALL VIAS TENTED | FLAT / CABLE | openSX70 project visit www.openSX70.com / version 6.2.5"ALPHA-2" 20181220 / by Joaquín de Prada